# EAGLE schematic PROJECT1 (EAGLE 9.6.2)
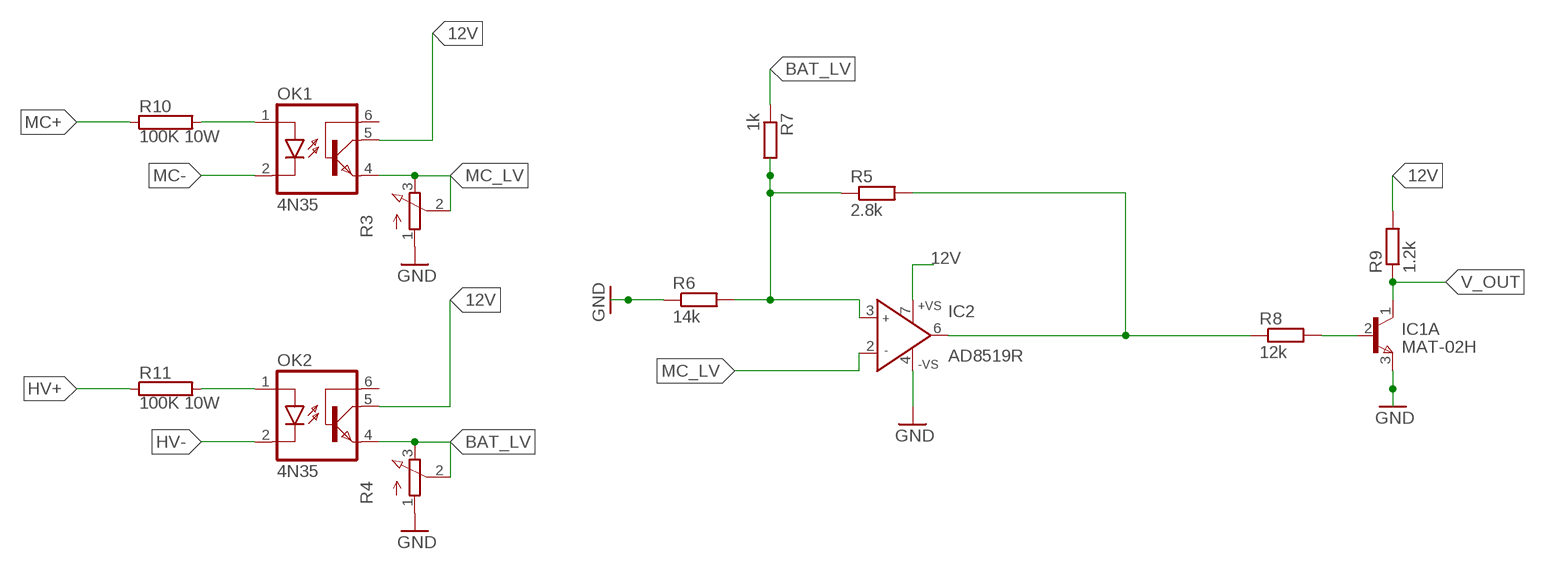
[diagram p0: schematic, sheet 1]

## Parts
IC1  MAT-02H  [TO78]
IC2  AD8519R  [SO8]
OK1  4N35  [DIL06]
OK2  4N35  [DIL06]
R3  3RP/1610N  [3RP/1610N]
R4  3RP/1610N  [3RP/1610N]
R5  2.8k  R-EU_0207/10  [0207/10]
R6  14k  R-EU_0207/10  [0207/10]
R7  1k  R-EU_0207/10  [0207/10]
R8  12k  R-EU_0207/10  [0207/10]
R9  1.2k  R-EU_0207/10  [0207/10]
R10  100K 10W  RMG100-V  [TO-247-2V]
R11  100K 10W  RMG100-V  [TO-247-2V]

## Nets
12V: IC2.7(+VS) OK1.5(COL) OK2.5(COL) R9.2
BAT_LV: OK2.4(EMI) R4.2(S) R4.3(E) R7.1
GND: IC1.3(A:E) IC2.4(-VS) R3.1(A) R4.1(A) R6.1
HV+: R11.1
HV-: OK2.2(C)
MC+: R10.1
MC-: OK1.2(C)
MC_LV: IC2.2(IN-) OK1.4(EMI) R3.2(S) R3.3(E)
N$1: OK1.1(A) R10.2
N$2: OK2.1(A) R11.2
N$3: IC2.3(IN+) R5.1 R6.2 R7.2
N$4: IC2.6(OUT) R5.2 R8.1
N$7: IC1.2(A:B) R8.2
V_OUT: IC1.1(A:C) R9.1
Unconnected: IC1.4(B:E) IC1.5(B:B) IC1.6(B:C) OK1.6(BAS) OK2.6(BAS)

## Library data of the parts
IC1 = linear:MAT-02H: Dual TRANSISTOR
IC2 = analog-devices:AD8519: 8 MHz Rail-to-Rail Operational Amplifiers Source: http://www.analog.com/static/imported-files/data_sheets/AD8519_8529.pdf; MPN: AD8519ARZ; OC_FARNELL: 9603840; OC_NEWARK: 19M8912
OK1 OK2 = optocoupler:4N35: MOTOROLA OPTO COUPLER; MF: FAIRCHILD SEMICONDUCTOR; MPN: 4N35; OC_FARNELL: 1328375; OC_NEWARK: 72K9946
R3 R4 = pot:3RP/1610N: 16mm Potentiometer one level Source: http://www.alphapotentiometers.net/html/16mm_pot_2.html
R5-R9 = rcl:R-EU_: RESISTOR, European symbol; SPICEPREFIX: R
R10 R11 = resistor-power:RMG100: TO-247 Power Resistor - RMG 100 Series Source: www.token.com.tw .. power-resistor-rmg100pdf; OC_FARNELL: unknown; OC_NEWARK: unknown